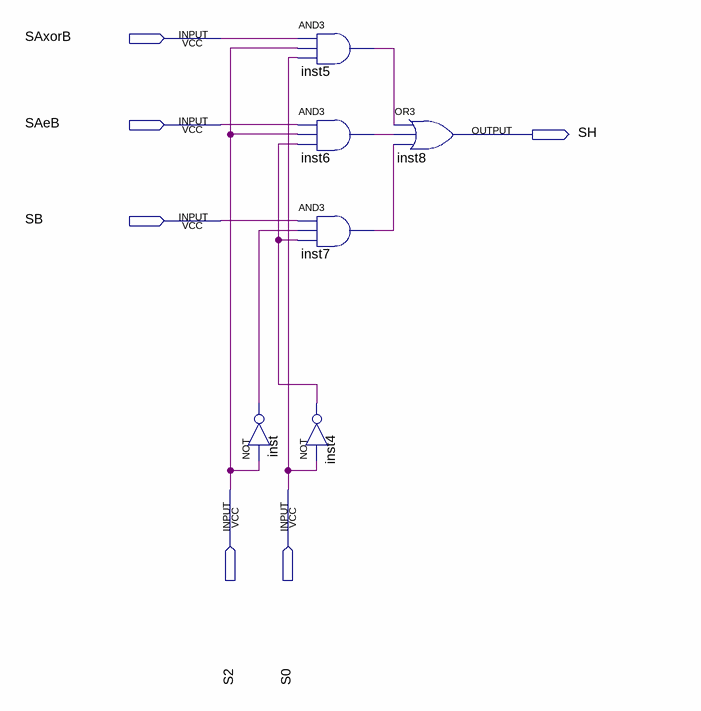
[diagram p0: schematic sheet]
// Quartus schematic Sinal_H.bdf as structural Verilog: 6 symbols, 6 pins
module Sinal_H (
  input  SAxorB,
  input  SAeB,
  input  SB,
  input  S2,
  input  S0,
  output SH
);

  wire inst4_out, inst5_out, inst6_out, inst7_out, inst_out;

  not inst (inst_out, S2);
  and inst5 (inst5_out, SAxorB, S2, S0);
  and inst6 (inst6_out, SAeB, S2, inst4_out);
  and inst7 (inst7_out, SB, inst_out, inst4_out);
  not inst4 (inst4_out, S0);
  or inst8 (SH, inst5_out, inst6_out, inst7_out);
endmodule
